# Altium schematic sheet BluetoothModule.SchDoc
size A4
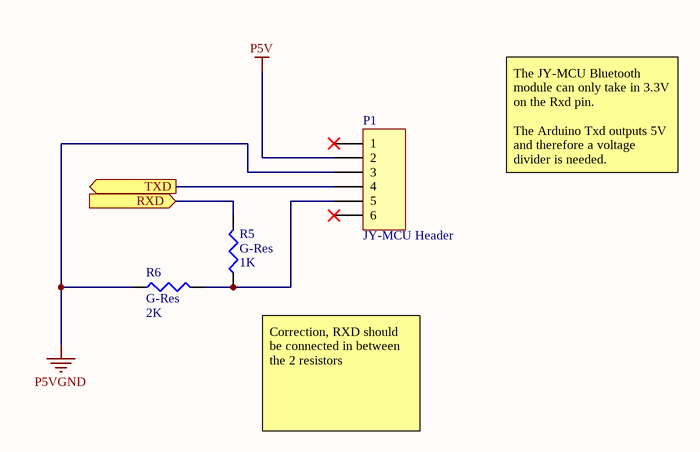
[diagram p0: BluetoothModule.SchDoc]

## Parts
P1  JY-MCU Header  [HDR1X6_LGE1.0]
R5  G-Res  value 1K  [Res2.54mm_LGE1.0]
R6  G-Res  value 2K  [Res2.54mm_LGE1.0]

## Ports
RXD (in), TXD (out)

## Nets
P5V: P1.2
P5VGND: P1.3 R6.1
RXD: R5.2 ; port RXD
TXD: P1.4 ; port TXD
NetP1_5: P1.5 R5.1 R6.2

Not connected (* = marked no-connect by the designer): P1 1* 6*

## Notes on the sheet
- The JY-MCU Bluetooth module can only take in 3.3V on the Rxd pin.
  The Arduino Txd outputs 5V and therefore a voltage divider is needed.
- Correction, RXD should be connected in between the 2 resistors

## Library data of the parts
P1 = C-Hdr1x6: Header, 6-Pin; LatestRevisionDate: 17-Jul-2002; LatestRevisionNote: Re-released for DXP Platform.; Publisher: Altium Limited
R5 R6 = G-Res: resistor (specify value); Published: 8-Jun-2000; LatestRevisionDate: 29-May-2009; LatestRevisionNote: IPC-7351 Footprint Added.; PackageReference: J1-0603; Publisher: Altium Limited; PackageDescription: Chip Resistor